# Altium schematic sheet BSPD_Simulation.SchDoc: QUTMS Shutdown V2.1 - BSPD Simulation
size A3; Author: Jonn Dillon; Organization: QUT Motorsport; Address1: O-120; Address2: O Block; Address3: QUT Gardens Point; Address4: Brisbane, 4000; DocumentNumber: 5; Revision: 11; SheetNumber: 5; SheetTotal: 7
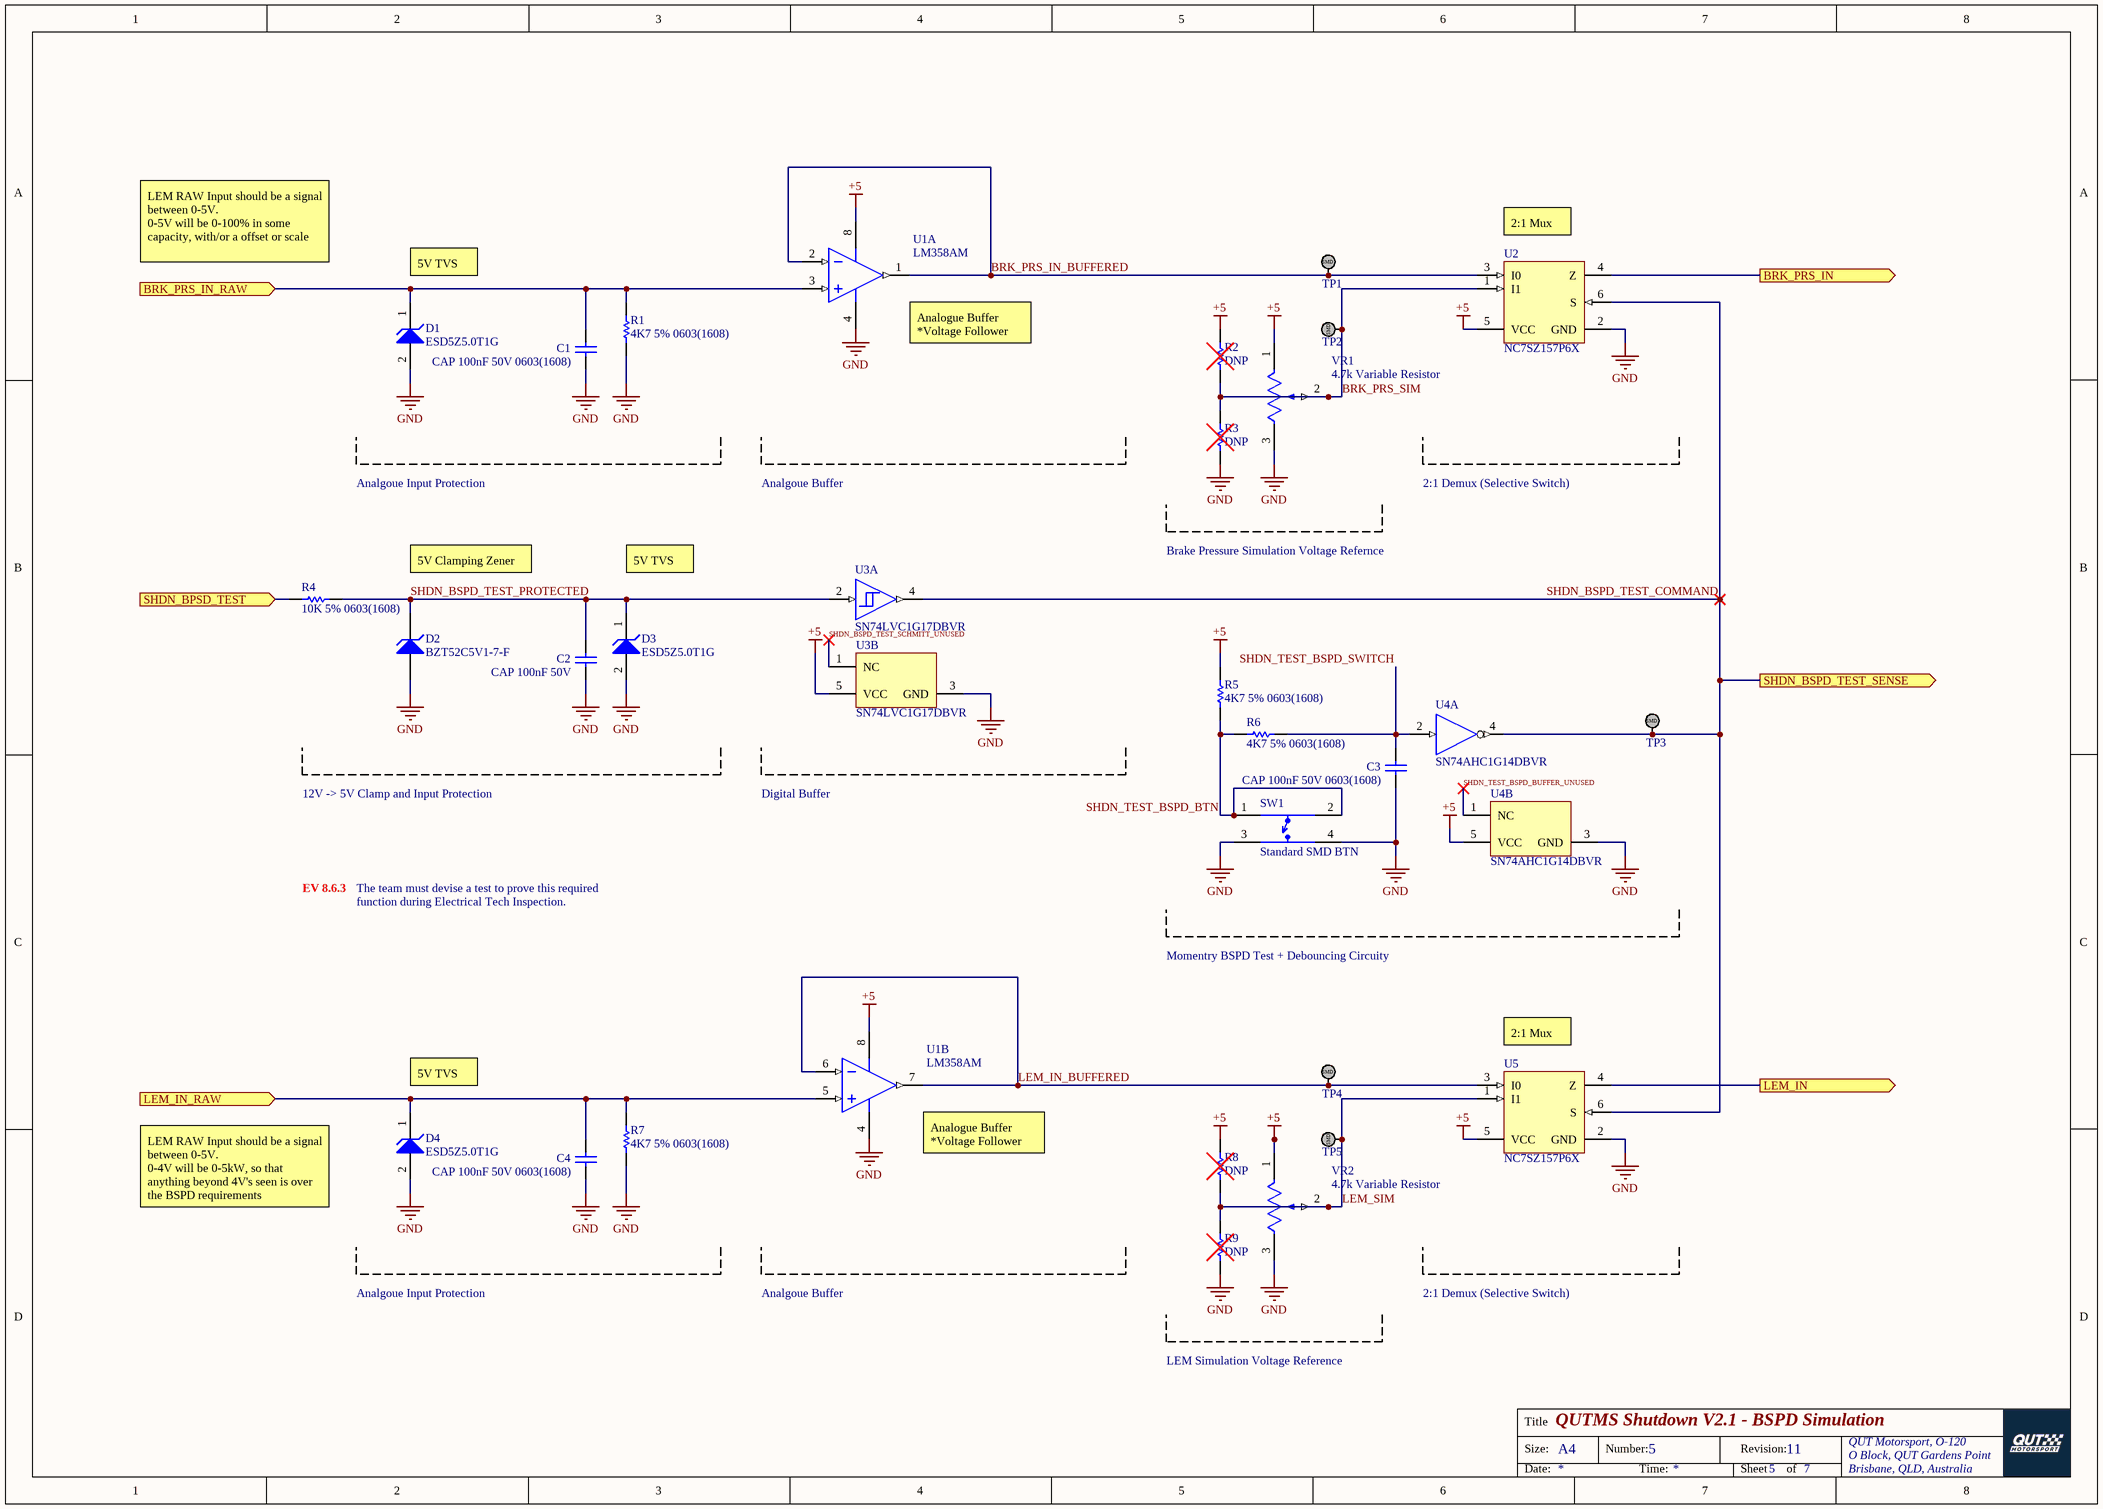
[diagram p0: BSPD_Simulation.SchDoc]

## Parts
C1  CAP 100nF 50V 0603(1608)  [CAPC0603(1608)100_L]
C2  CAP 100nF 50V  [CAPC0603(1608)100_L]
C3  CAP 100nF 50V 0603(1608)  [CAPC0603(1608)100_L]
C4  CAP 100nF 50V 0603(1608)  [CAPC0603(1608)100_L]
D1  ESD5Z5.0T1G  [ONSC-SOD-523-2-502-01_V]
D2  BZT52C5V1-7-F  [DIOD-SOD123_V]
D3  ESD5Z5.0T1G  [ONSC-SOD-523-2-502-01_V]
D4  ESD5Z5.0T1G  [ONSC-SOD-523-2-502-01_V]
R1  4K7 5% 0603(1608)  [RESC0603(1608)_N]
R2  DNP  [RESC0603(1608)_L]
R3  DNP  [RESC0603(1608)_L]
R4  10K 5% 0603(1608)  [RESC0603(1608)_N]
R5  4K7 5% 0603(1608)  [RESC0603(1608)_N]
R6  4K7 5% 0603(1608)  [RESC0603(1608)_N]
R7  4K7 5% 0603(1608)  [RESC0603(1608)_N]
R8  DNP  [RESC0603(1608)_L]
R9  DNP  [RESC0603(1608)_L]
SW1  Standard SMD BTN  [StandardSMDBTN]
TP1  TestPoint_SMD  [TestPointSMD]  (value not drawn)
TP2  TestPoint_SMD  [TestPointSMD]  (value not drawn)
TP3  TestPoint_SMD  [TestPointSMD]  (value not drawn)
TP4  TestPoint_SMD  [TestPointSMD]  (value not drawn)
TP5  TestPoint_SMD  [TestPointSMD]  (value not drawn)
U1  LM358AM  [D0008A_N]  (parts A,B of 2)
U2  NC7SZ157P6X  [FAIR-SC70-6_V]
U3  SN74LVC1G17DBVR  [DBV0005A_L]  (parts A,B of 2)
U4  SN74AHC1G14DBVR  [DBV0005A_L]  (parts A,B of 2)
U5  NC7SZ157P6X  [FAIR-SC70-6_V]
VR1  4.7k Variable Resistor  [VG039NCHXTB472]
VR2  4.7k Variable Resistor  [VG039NCHXTB472]

## Ports
BRK_PRS_IN (out), BRK_PRS_IN_RAW (in), LEM_IN (out), LEM_IN_RAW (in), SHDN_BPSD_TEST (in), SHDN_BSPD_TEST_SENSE (out)

## Nets
+5: R2.2 R5.2 R8.2 U1.8(V+) U2.5(VCC) U3.5(VCC) U4.5(VCC) U5.5(VCC) VR1.1 VR2.1
GND: C1.2 C2.2 C3.2 C4.2 D1.2(A) D2.1(A) D3.2(A) D4.2(A) R1.1 R3.1 R7.1 R9.1 SW1.3 SW1.4 U1.4(GND) U2.2(GND) U3.3(GND) U4.3(GND) U5.2(GND) VR1.3 VR2.3
BRK_PRS_IN: U2.4(Z) ; port BRK_PRS_IN
BRK_PRS_IN_BUFFERED: TP1.1 U1.1(OUTA) U1.2(INA-) U2.3(I0)
BRK_PRS_IN_RAW: C1.1 D1.1(K) R1.2 U1.3(INA+) ; port BRK_PRS_IN_RAW
BRK_PRS_SIM: R2.1 R3.2 TP2.1 U2.1(I1) VR1.2
LEM_IN: U5.4(Z) ; port LEM_IN
LEM_IN_BUFFERED: TP4.1 U1.6(INB-) U1.7(OUTB) U5.3(I0)
LEM_IN_RAW: C4.1 D4.1(K) R7.2 U1.5(INB+) ; port LEM_IN_RAW
LEM_SIM: R8.1 R9.2 TP5.1 U5.1(I1) VR2.2
SHDN_BPSD_TEST: R4.2 ; port SHDN_BPSD_TEST
SHDN_BSPD_TEST_COMMAND: TP3.1 U2.6(S) U3.4(Y) U4.4(Y) U5.6(S) ; port SHDN_BSPD_TEST_SENSE
SHDN_BSPD_TEST_PROTECTED: C2.1 D2.2(K) D3.1(K) R4.1 U3.2(A)
SHDN_BSPD_TEST_SCHMITT_UNUSED: U3.1(NC)
SHDN_TEST_BSPD_BTN: R5.1 R6.2 SW1.1 SW1.2
SHDN_TEST_BSPD_BUFFER_UNUSED: U4.1(NC)
SHDN_TEST_BSPD_SWITCH: C3.1 R6.1 U4.2(A)

## Notes on the sheet
- (near U2) 2:1 Mux
- LEM RAW Input should be a signal between 0-5V.
  0-5V will be 0-100% in some capacity, with/or a offset or scale
- 5V TVS
- (near U1) Analogue Buffer
  *Voltage Follower
- Analgoue Input Protection
- Analgoue Buffer
- 2:1 Demux (Selective Switch)
- 5V Clamping Zener
- Brake Pressure Simulation Voltage Refernce
- 12V -> 5V Clamp and Input Protection
- Digital Buffer
- EV 8.6.3
- The team must devise a test to prove this required
- function during Electrical Tech Inspection.
- Momentry BSPD Test + Debouncing Circuity
- (near U5) 2:1 Mux
- LEM RAW Input should be a signal between 0-5V.
  0-4V will be 0-5kW, so that anything beyond 4V's seen is over the BSPD requirements
  5V =
- LEM Simulation Voltage Reference
- Title
- Size:
- A4
- Number:
- Revision:
- QUT Motorsport, O-120
- O Block, QUT Gardens Point
- Date:
- Time:
- Sheet
- of
- Brisbane, QLD, Australia
- (in symbol TestPoint_SMD) SMD

## Library data of the parts
C1-C4 = CMP-1035-02591-1: CAP 100nF 50V ±5% 0603 (1608 Metric) Thickness 1mm SMD; Tolerance: Â±5%; Case-Metric: 1608; Case-EIA: 0603; Rated Voltage: 50 V; Max Thickness: 1 mm; Technology: SMT; Value: 100nF
D1 D3 D4 = CMP-1063-00102-1: Transient Voltage Suppressor, Micro-Packaged Diode for ESD Protection, 2-Pin SOD-523, Pb-Free, Tape and Reel; Manufacturer: On Semiconductor; V(BR) Min (V): 6.2; VRWM Max (V): 5; Number of Lines: 1; PPK Max (W): 174; IR Max (uA): 0.05; Direction: Unidirectional; PackageVersion: Rev. E, 09/2010; Mounting Technology: Surface Mount; Packing: Tape and Reel; ComponentLink2URL: http://www.onsemi.cn/pub_link/Collateral/ESD5Z2.5T1-D.PDF; ComponentLink2Description: Datasheet; PackageReference: SOD-523-2-502-01; ComponentLink1Description: Manufacturer URL; ComponentLink3URL: http://www.onsemi.com/pub_link/Collateral/502-01.PDF; PackageDescription: 2-Pin SOD, Body 1.2 x 0.8 mm; ComponentLink3Description: Package Specification; ComponentLink1URL: http://www.onsemi.com/; RoHS: Pb-Free; PartNumber: ESD5Z5.0T1G; DatasheetVersion: Rev. 10
D2 = CMP-2000-05976-1: Surface Mount Zener Diode, 5.1 V, -65 to 150 degC, 2-Pin SMD (SOD-123), RoHS, Tape and Reel; Manufacturer: DiodesIncorporated; Unit Weight: 0.000353oz; Zz - Zener Impedance: 60Ohms; Vz - Zener Voltage: 5.1V; Pd - Power Dissipation: 500mW; Zener Current: 5mA; Ir - Reverse Current: 2uA; Voltage Temperature Coefficient: -0.75mV/C; Configuration: Single; Voltage Tolerance: 6%; Height: 1.35mm; Width: 1.7mm; Minimum Operating Temperature: -65C; Series: BZT52C5; Package Description: 2-Pin Surface Mount Device, Body 2.7 x 1.55 mm; Length: 2.85mm; Mounting Technology: SurfaceMount; Brand: DiodesIncorporated; Factory Pack Quantity: 3000; Product Category: ZenerDiodes; RoHS: True; Manufacturer URL: http://www.diodes.com/; Termination Style: SMD/SMT; Package / Case: SOD-123; Packaging: Reel; Package Reference: SOD123; Datasheet Version: Rev. 37-2, 09/2012; Maximum Operating Temperature: +150C; Datasheet URL: http://www.diodes.com/_files/datasheets/ds18004.pdf; Mounting Style: SMD/SMT
R1 R5-R7 = CMP-1012-00090-1: 4K7 0.1W 5% 0603 (1608 Metric)  SMD; Case-Metric: 1608; Value: 4700.00 Ohm; Case-EIA: 0603; Tolerance: 5 %; Technology: SMT; Power: 0.1 W
R2 R3 R8 R9 = CMP-1591-00001-1: 0603 (1608 Metric) Chip Resistor; Case-Metric: 1608; Case-EIA: 0603; PackageReference: RESC0603(1608)
R4 = CMP-1012-00098-1: 10K 0.1W 5% 0603 (1608 Metric)  SMD; Case-EIA: 0603; Value: 10000.00 Ohm; Case-Metric: 1608; Technology: SMT; Tolerance: 5 %; Power: 0.1 W
SW1 = Standard SMD BTN: Cost common SMD button, 4 Lead; ComponentLink1Description: LCSC; ComponentLink1URL: https://lcsc.com/product-detail/Tactile-Switches_BRIGHT-TSA063G50-250_C294565.html
U1 = CMP-0055-00796-3: Low Power Dual Operational Amplifier, 8-pin Narrow SOIC; Manufacturer: Texas Instruments; CompType: Amplifiers; PackageTopMarking: NSZXTT*LM*358AM; PowerWise: N; Code_JEDEC: MS-012-AA; RoHS: N; PinCount: 8; Package Reference: D0008A; ComponentLink1Description: Datasheet URL; ComponentLink1URL: http://www.ti.com/general/docs/lit/getliterature.tsp?genericPartNumber=LM358-N&fileType=pdf; Code_IPC: SOIC127P600-8; PackageDescription: SOIC Narrow, 4.9 x 3.9 x 1.45mm, 8 Lead, 1.27mm Pitch
U2 U5 = CMP-2000-06819-1: Tinylogic(R) UHS 2-Input Non-Inverting Multiplexer, 1.65 to 5.5 V, -40 to 85 degC, 6-Pin SOT23 (SC70), RoHS, Tape and Reel; Manufacturer: FairchildSemiconductor; Maximum Low Level Output Current: 32mA; Configuration: 1x2:1; Logic Family: TinyLogicUHS; Maximum Operating Supply Voltage: 5.5V; Number of Inputs per Chip: 2; Maximum Propagation Delay Time @ Maximum CL: 4.6@3.3V; Maximum High Level Output Current: -32mA; Rad Hard: No; Minimum Operating Supply Voltage: 1.65V; Tolerant I/Os: 5.5InputsV; Package: 6SC-70; Package Description: 6-Pin Small Outline Transistor, Body 2 x 1.25 mm, Pitch 0.65 mm; Datasheet Version: 09/2009; Mounting Technology: SurfaceMount; Package URL: https://www.fairchildsemi.com/package-drawings/MA/MAA06A.pdf; Package Reference: SC70-6; Category: Multiplexer; Manufacturer URL: https://www.fairchildsemi.com/; Logic Function: Multiplexer; Packaging: Tape&Reel; Datasheet URL: https://www.fairchildsemi.com/datasheets/NC/NC7SZ157.pdf
U3 = CMP-0859-00033-4: Single Schmitt-Trigger Buffer, DBV0005A, LARGE T&R; Manufacturer: Texas Instruments; Output Drive (IOL/IOH)(Max)(mA): 32/-32; Technology Family: LVC; ICC @ Nom Voltage(Max)(mA): 0.01; VCC(Min)(V): 1.65; F @ Nom Voltage(Max)(Mhz): 150; Schmitt Trigger: Yes; Voltage(Nom)(V): 1.8,2.5,3.3,5; 3-State Output: No; Bits(#): 1; VCC(Max)(V): 5.5; Input Type: CMOS/TTL; Logic: True; tpd @ Nom Voltage(Max)(ns): 11,6.5,5.5,5; Output Type: CMOS; Rating: Catalog; Sub-Family: Non-Inverting Buffer/Driver; PackageReference: DBV0005A; DatasheetVersion: SCES351V; Generic Part Number: SN74LVC1G17; Operating Temperature Range(C): -40 to 125,-40 to 85
U4 = CMP-2000-07131-1: Single Schmitt-Trigger Inverter Gate, 10.6 ns max, 2 to 5.5 V, -40 to 125 degC, 5-Pin SOT23 (DBV), Green (RoHS & no Sb/Br), Tape and Reel; Manufacturer: Texas Instruments; Supply Voltage Min: 2V; Logic IC Function: SingleInverterwithSchmittTrigger; No. of Pins: 5; Logic IC Family: AHC; Output Current: 8mA; Supply Voltage: 5.5V; Logic Function Number: 741G14; SVHC: NoSVHC(19-Dec-2012); No. of Gates: 1; Base Number: 74; Supply Voltage Range: 2Vto5.5V; Logic IC Base Number: 74114; Logic Case Style: SOT-23; Datasheet Version: Rev. Q, 09/2015; Mounting Technology: SurfaceMount; Termination Type: SMD; Operating Temperature Max: 85°C; IC Generic Number: 74AHC1G14; Operating Temperature Min: -40°C; No. of Inputs: 1; Supply Voltage Max: 5.5V; Datasheet URL: http://www.ti.com/lit/ds/symlink/sn74ahc1g14.pdf; Package Description: 5-Pin Small Outline Transistor, Body 2.9 x 1.6 mm, Pitch 0.95 mm; Operating Temperature Range: -40°Cto+85°C; Output Current Max: 8mA; Package URL: http://www.ti.com/lit/ml/mpds018l/mpds018l.pdf; Package Reference: DBV0005A; Logic Type: Inverter; Manufacturer URL: http://www.ti.com/; Package / Case: SOT-23
VR1 VR2 = 4.7k Variable Resistor: 4k7 ±25% ±250 ppm/°C SMD Variable Resistors RoHS | VG039NCHXTB472; ComponentLink1Description: LCSC; ComponentLink1URL: https://lcsc.com/product-detail/Variable-Resistors_HDK-Hokuriku-Elec-Industry-VG039NCHXTB472_C128555.html